# Altium schematic sheet SY8029AIC-SCH.SchDoc
size A4
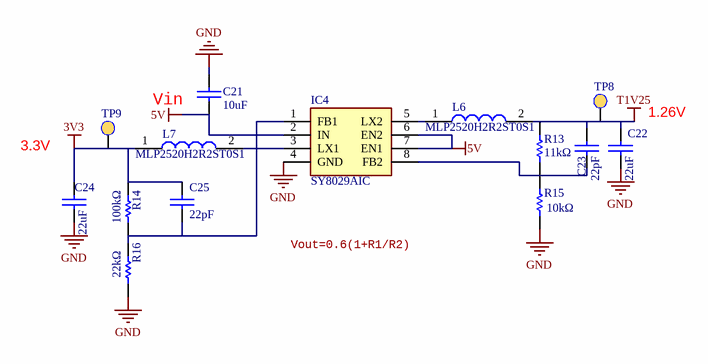
[diagram p0: SY8029AIC-SCH.SchDoc]

## Parts
C21  10uF  [C_0805]
C22  22uF  [C_0603]
C23  22pF  [C_0402]
C24  22uF  [C_0603]
C25  22pF  [C_0402]
IC4  SY8029AIC  [SOT23-8]
L6  MLP2520H2R2ST0S1  [INDC2520X100N]
L7  MLP2520H2R2ST0S1  [INDC2520X100N]
R13  11kΩ  [R_0402]
R14  100kΩ  [R_0402]
R15  10kΩ  [R_0402]
R16  22kΩ  [R_0402]
TP8  TP  [TP1.4mm]  (value not drawn)  (no BOM)
TP9  TP  [TP1.4mm]  (value not drawn)  (no BOM)

## Nets
3V3: C24.1 C25.2 L7.1 R14.1 TP9.1(TP)
5V: C21.1 IC4.2(IN) IC4.6(EN2) IC4.7(EN1)
GND: C21.2 C22.2 C24.2 IC4.4(GND) R15.1 R16.2
T1V25: C22.1 C23.1 L6.2 R13.2 TP8.1(TP)
NetC23_2: C23.2 IC4.8(FB2) R13.1 R15.2
NetC25_1: C25.1 IC4.1(FB1) R14.2 R16.1
NetIC4_3: IC4.3(LX1) L7.2
NetIC4_5: IC4.5(LX2) L6.1

## Notes on the sheet
- Vin
- 1.26V
- 3.3V
- Vout=0.6(1+R1/R2)

## Library data of the parts
C21-C25 = Cap_Chip: 贴片电容; Manufacturer_Name: SAMSUNG(三星); Manufacturer_Part_Number: ±10% /25V; Manufacturer_Name_1: YAGEO(国巨); Manufacturer_Part_Number_1: ±10% /25V
IC4 = SY8029AIC: DC-DC降压芯片; Manufacturer_Name: Silergy Corp; Datasheet Link: https://datasheet.lcsc.com/szlcsc/Silergy-Corp-SY8029AIC_C207636.pdf; Manufacturer_Part_Number: SY8029AIC
L6 L7 = MLP2520K1R0MT0S1: Inductor; Manufacturer_Name: TDK; Manufacturer_Name_1: muRata(村田); Manufacturer_Part_Number_1: 1239AS-H-2R2M=P2; Manufacturer_Part_Number: MLP2520K1R0MT0S1
R13-R15 = Res_Chip: 贴片电阻; Manufacturer_Name: UNI-ROYAL(厚声); Manufacturer_Part_Number: ±1%; Manufacturer_Name_1: YAGEO(国巨); Manufacturer_Part_Number_1: ±1%
R16 = Res_Chip: 贴片电阻; Manufacturer_Part_Number: ±1%; Manufacturer_Name: UNI-ROYAL(厚声); Manufacturer_Name_1: YAGEO(国巨); Manufacturer_Part_Number_1: ±1%
TP8 TP9 = TP: 测试点